# Altium schematic sheet Connectors.SchDoc
size A; DocumentNumber: 5; SheetNumber: 5; SheetTotal: 5
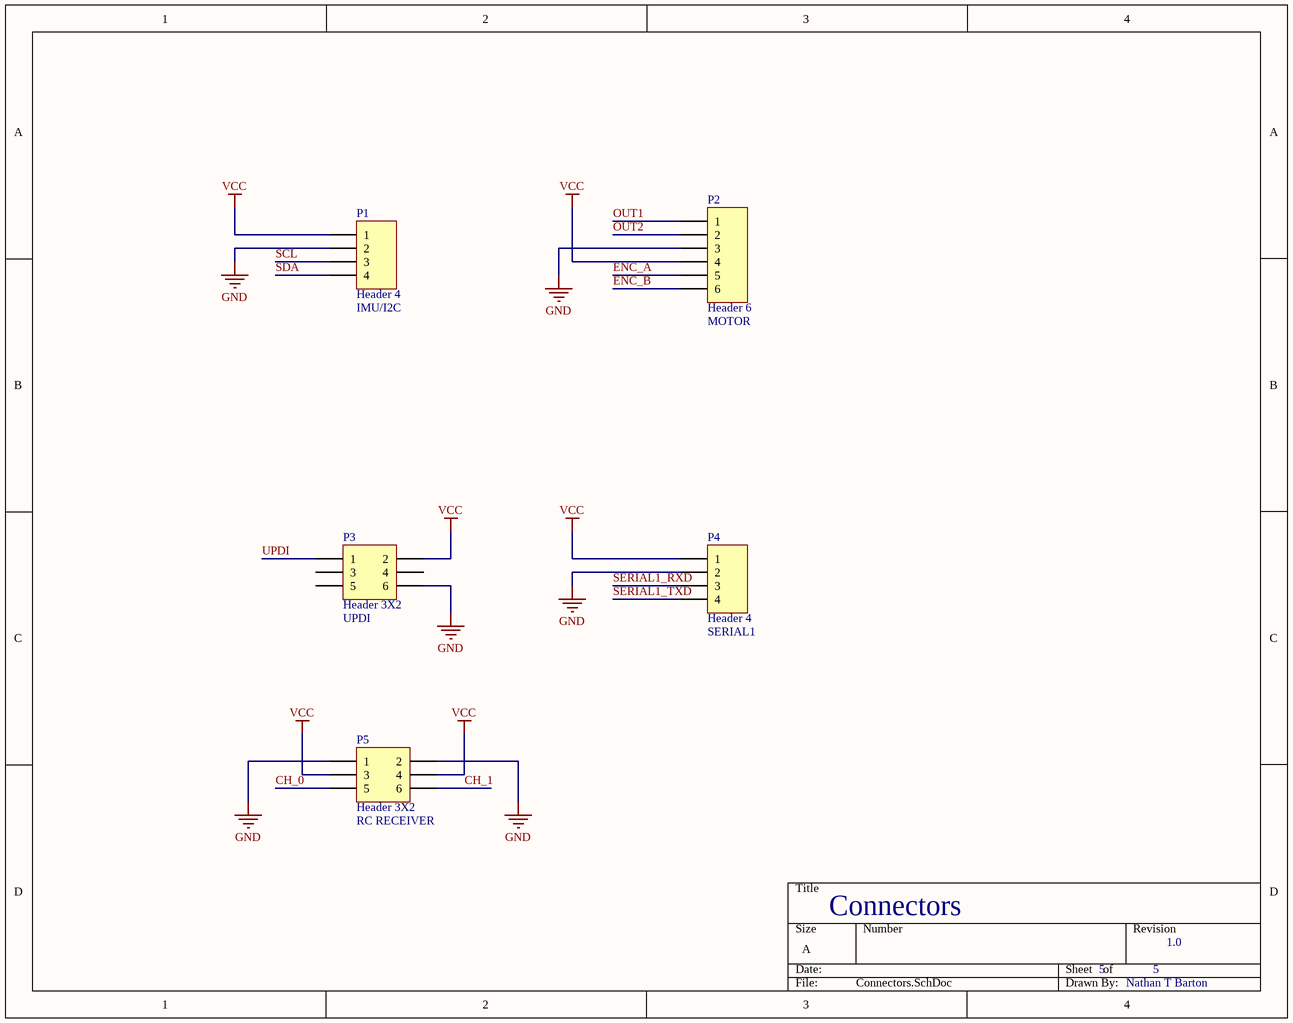
[diagram p0: Connectors.SchDoc]

## Parts
P1  Header 4  [HDR1X4]
P2  Header 6  [HDR1X6]
P3  Header 3X2  [HDR2X3]
P4  Header 4  [HDR1X4]
P5  Header 3X2  [HDR2X3]

## Nets
GND: P1.2 P2.3 P3.6 P4.2 P5.1 P5.2
VCC: P1.1 P2.4 P3.2 P4.1 P5.3 P5.4
CH_0: P5.5
CH_1: P5.6
ENC_A: P2.5
ENC_B: P2.6
OUT1: P2.1
OUT2: P2.2
SCL: P1.3
SDA: P1.4
SERIAL1_RXD: P4.3
SERIAL1_TXD: P4.4
UPDI: P3.1

Not connected (* = marked no-connect by the designer): P3 3 4 5

## Notes on the sheet
- (near P1) IMU/I2C
- (near P2) MOTOR
- (near P3) UPDI
- (near P4) SERIAL1
- (near P5) RC RECEIVER
- Connectors
- 5
- 1.0
- Nathan T Barton

## Library data of the parts
P1 P4 = Header 4: Header, 4-Pin; LatestRevisionDate: 17-Jul-2002; LatestRevisionNote: Re-released for DXP Platform.; Publisher: Altium Limited
P2 = Header 6: Header, 6-Pin; LatestRevisionDate: 17-Jul-2002; LatestRevisionNote: Re-released for DXP Platform.; Publisher: Altium Limited
P3 P5 = Header 3X2: Header, 3-Pin, Dual row; LatestRevisionDate: 17-Jul-2002; LatestRevisionNote: Re-released for DXP Platform.; Publisher: Altium Limited